# EAGLE design RN2483_01 (EAGLE 6.1)
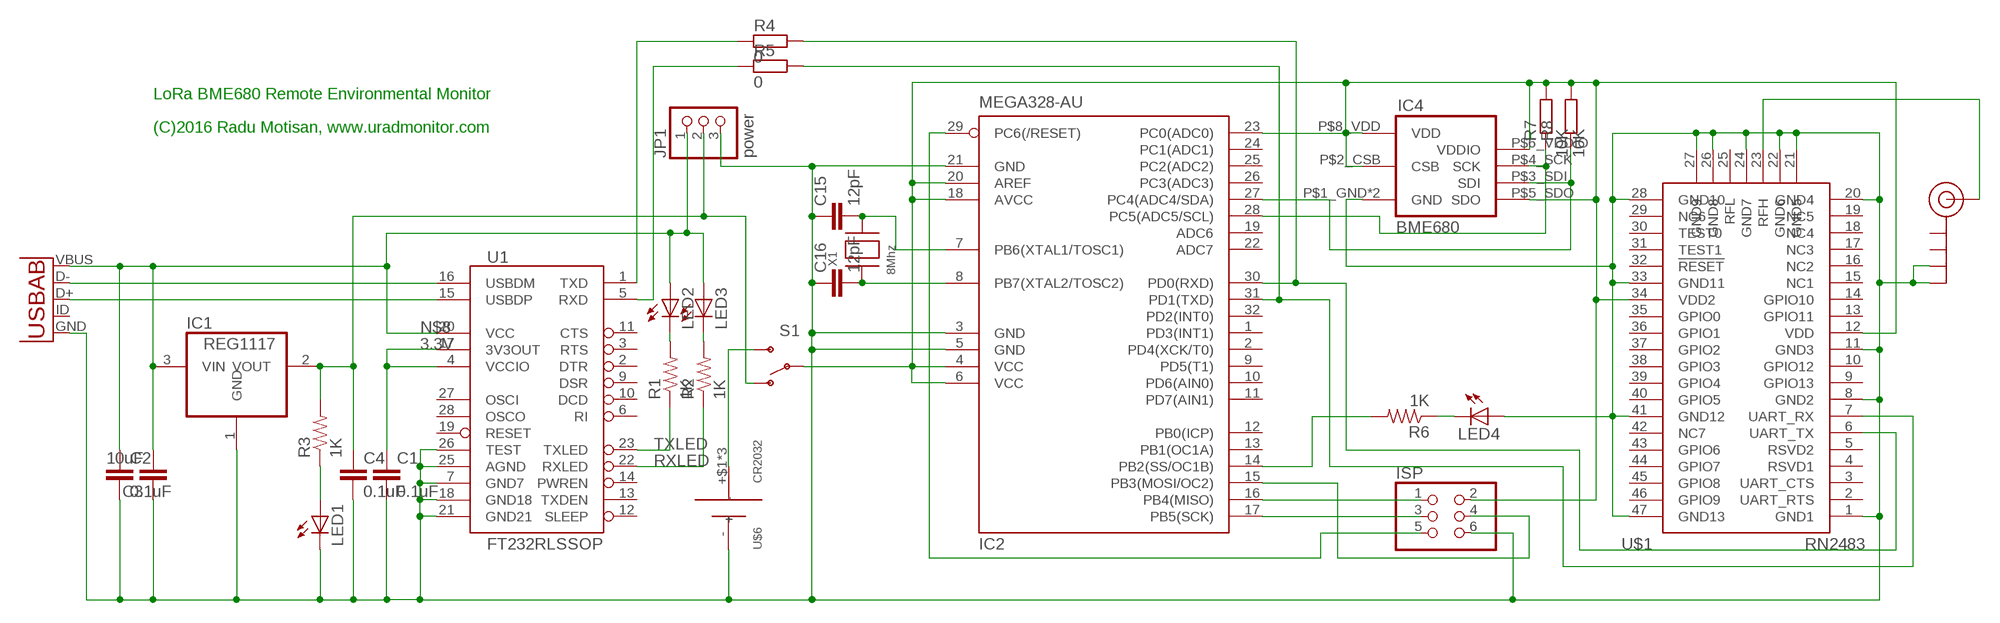
[diagram p0: schematic, sheet 1]

## Parts
C1  0.1uF  CAP0805  [0805]
C2  0.1uF  CAP0805  [0805]
C3  10uF  C-EUC0805K  [C0805K]
C4  0.1uF  CAP0805  [0805]
C15  12pF  C-EUC0805K  [C0805K]
C16  12pF  C-EUC0805K  [C0805K]
IC1  REG1117  [SOT223]
IC2  MEGA328-AU  MEGA8-AI  [TQFP32-08]
IC4  BME680  [BME680]
ISP  PINHD-2X3  [2X03]
J$1  SMA_EDGE  [SMA-EDGE]
JP1  power  PINHD-1X3  [1X03]
LED1  LEDCHIP-LED0805  [CHIP-LED0805]
LED2  LEDCHIP-LED0805  [CHIP-LED0805]
LED3  LEDCHIP-LED0805  [CHIP-LED0805]
LED4  LEDCHIP-LED0805  [CHIP-LED0805]
R1  1K  RESISTOR0805-RES  [0805]
R2  1K  RESISTOR0805-RES  [0805]
R3  1K  RESISTOR0805-RES  [0805]
R4  0  R-EU_R0805  [R0805]
R5  0  R-EU_R0805  [R0805]
R6  1K  RESISTOR0805-RES  [0805]
R7  10K  R-EU_R0805  [R0805]
R8  10K  R-EU_R0805  [R0805]
S1  SWITCH-SPDT-SMD-A  [SWITCH-SPST-SMD-A]
U1  FT232RLSSOP  [SSOP28DB]
U$1  RN2483  [RN2483]
U$2  USB_AB  [USB-AB-MICRO-SMD]
U$6  CR2032  [CR2032]
X1  8Mhz  XTALNX5032  [NX5032]

## Nets
3.3V [power]: C1.1 U1.4(VCCIO) U1.17(3V3OUT)
GND: C1.2 C2.2 C3.1 C4.2 C15.1 C16.1 IC1.1(GND) IC2.3(GND) IC2.5(GND) IC2.21(GND) IC4.P$1_GND(GND) IC4.P$7_GND(GND) ISP.6 J$1.GND@2(GND) J$1.GND@3(GND) JP1.3 LED1.C LED4.A U1.7(GND7) U1.18(GND18) U1.21(GND21) U1.25(AGND) U1.26(TEST) U$1.1(GND1) U$1.8(GND2) U$1.11(GND3) U$1.20(GND4) U$1.21(GND5) U$1.22(GND6) U$1.24(GND7) U$1.26(GND8) U$1.27(GND9) U$1.28(GND10) U$1.33(GND11) U$1.41(GND12) U$1.47(GND13) U$2.GND U$6.-
N$1: LED2.C R1.2
N$2: LED3.C R2.2
N$3: U1.16(USBDM) U$2.D-
N$4: U1.15(USBDP) U$2.D+
N$5: C4.1 IC1.2(VOUT) JP1.2 R3.2 S1.1(O)
N$6: IC2.30(PD0(RXD)) R4.2 U$1.6(UART_TX)
N$7: IC2.14(PB2(SS/OC1B)) R6.2
N$8: C2.1 C3.2 IC1.3(VIN) JP1.1 LED2.A LED3.A U1.20(VCC) U$2.VBUS
N$9: R4.1 U1.1(TXD)
N$10: S1.3(S) U$6.+$1(+) U$6.+$2(+) U$6.+$3(+)
N$11: IC2.16(PB4(MISO)) ISP.1
N$12: IC2.17(PB5(SCK)) ISP.3
N$13: IC2.15(PB3(MOSI/OC2)) ISP.4
N$14: IC2.29(PC6(/RESET)) ISP.5
N$15: J$1.SIG(SIGNAL) U$1.23(RFH)
N$16: LED4.C R6.1
N$17: C15.2 IC2.7(PB6(XTAL1/TOSC1)) X1.P$2
N$18: C16.2 IC2.8(PB7(XTAL2/TOSC2)) X1.P$1
N$19: R5.1 U1.5(RXD)
N$25: IC2.28(PC5(ADC5/SCL)) IC4.P$4_SCK(SCK) R7.1
N$26: IC2.27(PC4(ADC4/SDA)) IC4.P$3_SDI(SDI) R8.1
N$44: IC2.31(PD1(TXD)) R5.2 U$1.7(UART_RX)
N$45: LED1.A R3.1
RXLED: R2.1 U1.22(RXLED)
TXLED: R1.1 U1.23(TXLED)
VCC: IC2.4(VCC) IC2.6(VCC) IC2.18(AVCC) IC2.20(AREF) IC2.23(PC0(ADC0)) IC4.P$2_CSB(CSB) IC4.P$5_SDO(SDO) IC4.P$6_VDDIO(VDDIO) IC4.P$8_VDD(VDD) ISP.2 R7.2 R8.2 S1.2(P) U$1.12(VDD) U$1.34(VDD2)
Unconnected: IC2.1(PD3(INT1)) IC2.2(PD4(XCK/T0)) IC2.9(PD5(T1)) IC2.10(PD6(AIN0)) IC2.11(PD7(AIN1)) IC2.12(PB0(ICP)) IC2.13(PB1(OC1A)) IC2.19(ADC6) IC2.22(ADC7) IC2.24(PC1(ADC1)) IC2.25(PC2(ADC2)) IC2.26(PC3(ADC3)) IC2.32(PD2(INT0)) J$1.GND@0(GND) J$1.GND@1(GND) U1.2(DTR) U1.3(RTS) U1.6(RI) U1.9(DSR) U1.10(DCD) U1.11(CTS) U1.12(SLEEP) U1.13(TXDEN) U1.14(PWREN) U1.19(RESET) U1.27(OSCI) U1.28(OSCO) U$1.2(UART_RTS) U$1.3(UART_CTS) U$1.4(RSVD1) U$1.5(RSVD2) U$1.9(GPIO13) U$1.10(GPIO12) U$1.13(GPIO11) U$1.14(GPIO10) U$1.15(NC1) U$1.16(NC2) U$1.17(NC3) U$1.18(NC4) U$1.19(NC5) U$1.25(RFL) U$1.29(NC6) U$1.30(TEST0) U$1.31(TEST1) U$1.32(!RESET) U$1.35(GPIO0) U$1.36(GPIO1) U$1.37(GPIO2) U$1.38(GPIO3) U$1.39(GPIO4) U$1.40(GPIO5) U$1.42(NC7) U$1.43(GPIO6) U$1.44(GPIO7) U$1.45(GPIO8) U$1.46(GPIO9) U$2.ID(USBID)

## Notes on the sheet
- LoRa BME680 Remote Environmental Monitor
- (C)2016 Radu Motisan, www.uradmonitor.com

## Library data of the parts
C1 C2 C4 = SparkFun:CAP: Capacitor Standard 0603 ceramic capacitor, and 0.1" leaded capacitor.
C3 C15 C16 = rcl:C-EU: CAPACITOR, European symbol
IC1 = burr-brown:REG1117: 800mA and 1A Low Dropout (LDO) Positive Regulator 1.8V, 2.5V, 2.85V, 3.3V, 5V, and Adj; MPN: REG1117; OC_FARNELL: 1097566; OC_NEWARK: 14P6981
IC2 = atmel:MEGA8: MICROCONTROLLER 8 Kbytes FLASH, 1 kbytes SRAM, 512 bytes EEPROM, USART, 6-channel 10 bit ADC, 2-channel 8 bit ADC Pin compatible with Atmega48, ATMega88, ATMega168 Source: avr.lbr; MPN: ATMEGA8-16AU; OC_FARNELL: 9171371; OC_NEWARK: 73M8863
IC4 = uradmonitor:BME680
ISP = pinhead:PINHD-2X3: PIN HEADER
J$1 = sparkfun-connectors:SMA_EDGE: SMA Antenna Connector End launch SMA connector. The paste layer has been removed so that the connector can be hand soldered onto the board after reflow.
JP1 = adafruit:PINHD-1X3: PIN HEADER
LED1-LED4 = adafruit:LED: LED OSRAM: - CHIPLED LG R971, LG N971, LY N971, LG Q971, LY Q971, LO R971, LY R971 LH N974, LH R974 LS Q976, LO Q976, LY Q976 LO Q996 - Hyper CHIPLED LW Q18S LB Q993, LB Q99A, LB R99A - SideLED LS A670, LO A670, LY A670, LG A670, LP A670 LB A673, LV A673, LT A673, LW A673 LH A674 LY A675 LS A676, LA A676, LO A676, LY A676, LW A676 LS A679, LY A679, LG A679 - Hyper Micro SIDELED® LS Y876, LA Y876, LO Y876, LY Y876 LT Y87S - SmartLED LW L88C, LW L88S LB L89C, LB L89S, LG L890 LS L89K, LO L89K, LY L89K LS L896, LA L896, LO L896, LY L896 - TOPLED LS T670, LO T670, LY T670, LG T670, LP T670 LSG T670, LSP T670, LSY T670, LOP T670, LYG T670 LG T671, LOG T671, LSG T671 LB T673, LV T673, LT T673, LW T673 LH T674 LS T676, LA T676, LO T676, LY T676, LB T676, LH T676, LSB T676, LW T676 LB T67C, LV T67C, LT T67C, LS T67K, LO T67K, LY T67K, LW E67C LS E67B, LA E67B, LO E67B, LY E67B, LB E67C, LV E67C, LT E67C LW T67C LS T679, LY T679, LG T679 LS T770, LO T770, LY T770, LG T770, LP T770 LB T773, LV T773, LT T773, LW T773 LH T774 LS E675, LA E675, LY E675, LS T675 LS T776, LA T776, LO T776, LY T776, LB T776 LHGB T686 LT T68C, LB T68C - Hyper Mini TOPLED® LB M676 - Mini TOPLED Santana® LG M470 LS M47K, LO M47K, LY M47K Source: http://www.osram.convergy.de/
R1-R3 R6 = SparkFun:RESISTOR: Resistor Basic schematic elements and footprints for 0603, 1206, and PTH resistors.
R4 R5 R7 R8 = rcl:R-EU_: RESISTOR, European symbol
S1 = sparkfun-electromechanical:SWITCH-SPDT: SPDT Switch Simple slide switch, Spark Fun Electronics SKU : COM-00102 DPDT SMT slide switch, AYZ0202, SWCH-08179
U1 = SparkFun:FT232RL: USB UART FT232RL 4th Generation USB UART (USB <-> Serial) Controller. Spark Fun Electronics SKU : COM-00650
U$1 = uradmonitor:RN2483
U$2 = sparkfun-connectors:USB_AB: This is a USB AB connector that is compatible with USB OTG. i.e. this connector can serve as a host or device
U$6 = uradmonitor:CR2032
X1 = adafruit:XTAL: Low cost SMT crystals, no capacitors included http://www.ladyada.net/library/eagle

## Net classes
1 power: width 0.254 mm

## Board
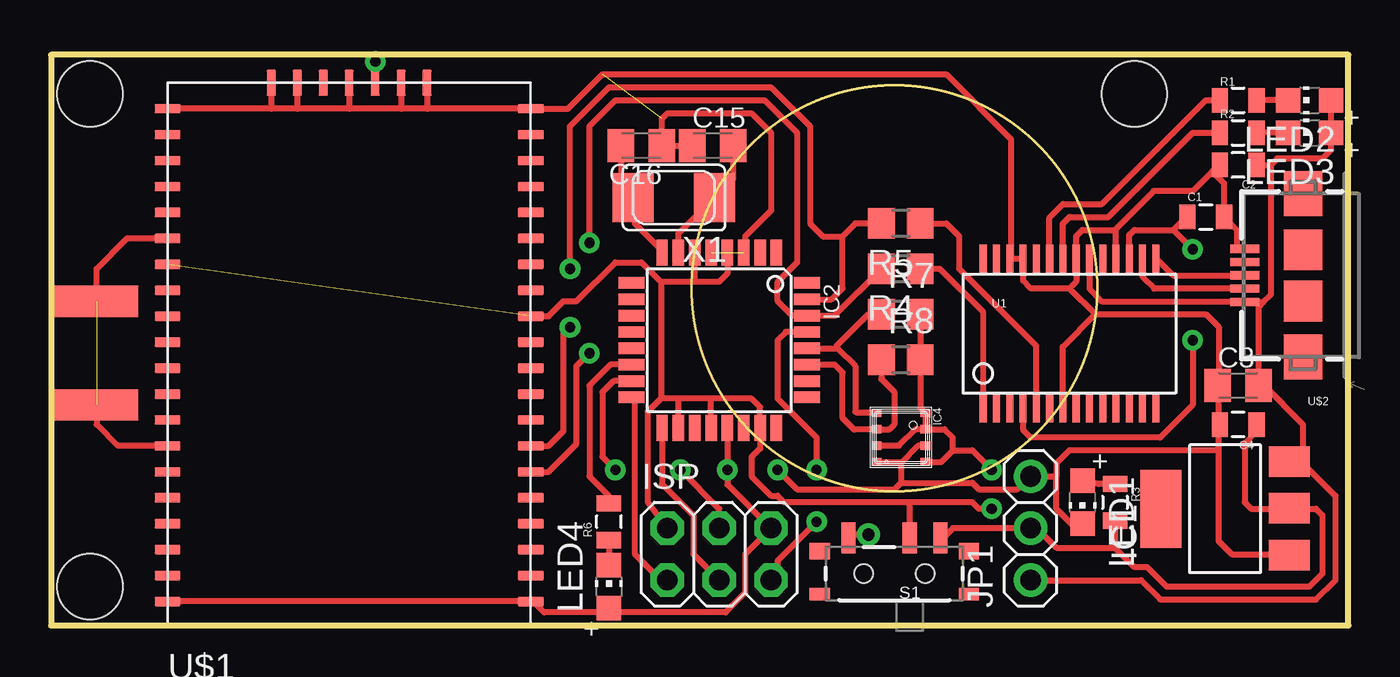
[diagram p1: board, top side]
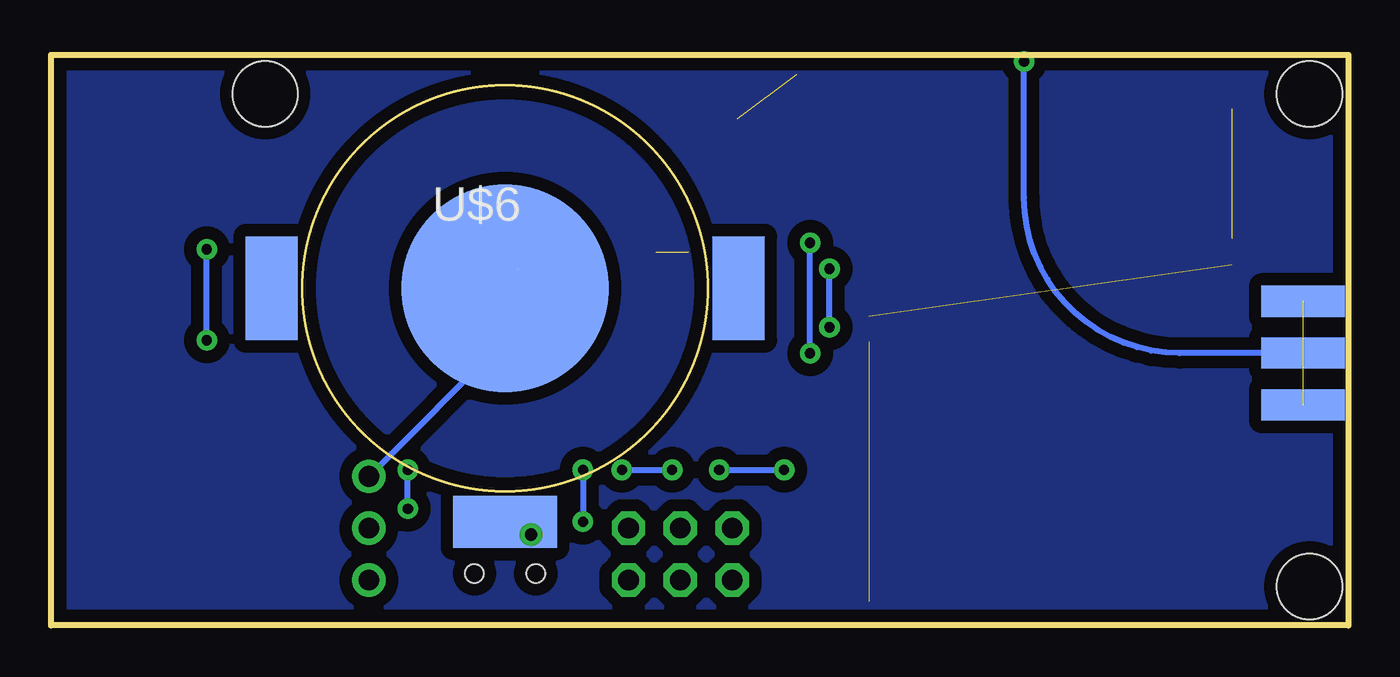
[diagram p2: board, bottom side, seen from below]

Size 63.5 x 27.94 mm. Coordinates in mm from the lower left corner, seen from the top.
Outline: 63.5,27.94 0,27.94 0,0 63.5,0 63.5,27.94
Copper layers (1*16): Top 0.035mm / dielectric 1.5mm / Bottom 0.035mm
Design rules: minimum track width 8mil, minimum drill 20mil, track to track 8mil, track to pad 8mil, pad to pad 8mil, via to via 8mil, smd to smd 8mil, copper to edge 8mil, drill to drill 8mil, minimum pad ring 12mil, minimum via ring 10mil, stop-mask expansion 4mil, vias tented up to drill 20mil, thermal gap 10mil
Holes 3.2 mm at 1.91,26.03 1.91,1.9 53.02,26.03

### Footprints (pad centres in the part's own frame; a part is rotated, then mirrored left to right if it is on the bottom)
0805 = smd 0.8 x 1.2: 1 -0.9,0; 2 0.9,0
C0805K = smd 1.3 x 1.6: 1 -1,0; 2 1,0
SOT223 = smd 1.499 x 2.007: 1 -2.261,-3.15; 2 0.025,-3.15; 3 2.311,-3.15 | smd 3.81 x 2.007: 4 0,3.15
TQFP32-08 = smd 1.27 x 0.559: 1 -4.293,2.8; 2 -4.293,2; 3 -4.293,1.2; 4 -4.293,0.4; 5 -4.293,-0.4; 6 -4.293,-1.2; 7 -4.293,-2; 8 -4.293,-2.8; 17 4.293,-2.8; 18 4.293,-2; 19 4.293,-1.2; 20 4.293,-0.4; 21 4.293,0.4; 22 4.293,1.2; 23 4.293,2; 24 4.293,2.8 | smd 0.559 x 1.27: 9 -2.8,-4.293; 10 -2,-4.293; 11 -1.2,-4.293; 12 -0.4,-4.293; 13 0.4,-4.293; 14 1.2,-4.293; 15 2,-4.293; 16 2.8,-4.293; 25 2.8,4.293; 26 2,4.293; 27 1.2,4.293; 28 0.4,4.293; 29 -0.4,4.293; 30 -1.2,4.293; 31 -2,4.293; 32 -2.8,4.293
BME680 = smd 0.4 x 0.5: P$1_GND 1.2,-1.2; P$2_CSB 0.4,-1.2; P$3_SDI -0.4,-1.2; P$4_SCK -1.2,-1.2; P$5_SDO -1.2,1.2; P$6_VDDIO -0.4,1.2; P$7_GND 0.4,1.2; P$8_VDD 1.2,1.2
2X03 = drill 1.016 octagon: 1 -2.54,-1.27; 2 -2.54,1.27; 3 0,-1.27; 4 0,1.27; 5 2.54,-1.27; 6 2.54,1.27
SMA-EDGE = smd 1.524 x 4.064: GND@0 0,0; GND@1 5.08,0; SIG 2.54,0 | smd 1.524 x 4.064 bottom: GND@2 0,0; GND@3 5.08,0
1X03 = drill 1.016: 1 -2.54,0; 2 0,0; 3 2.54,0
CHIP-LED0805 = smd 1.2 x 1.2: A 0,-1.05; C 0,1.05
R0805 = smd 1.3 x 1.5: 1 -0.95,0; 2 0.95,0
SWITCH-SPST-SMD-A = smd 0.7 x 1.5: 1 -2.25,-1.75; 2 -0.75,-1.75; 3 2.25,-1.75 | smd 1 x 0.6: GND1 -3.65,1; GND3 3.65,1 | smd 1 x 0.8: GND2 -3.65,-1.1; GND4 3.65,-1.1 | hole 0.9: -1.5,0; 1.5,0
SSOP28DB = smd 0.348 x 1.397: 1 -4.225,-3.656; 2 -3.575,-3.656; 3 -2.925,-3.656; 4 -2.275,-3.656; 5 -1.625,-3.656; 6 -0.975,-3.656; 7 -0.325,-3.656; 8 0.325,-3.656; 9 0.975,-3.656; 10 1.625,-3.656; 11 2.275,-3.656; 12 2.925,-3.656; 13 3.575,-3.656; 14 4.225,-3.656; 15 4.225,3.656; 16 3.575,3.656; 17 2.925,3.656; 18 2.275,3.656; 19 1.625,3.656; 20 0.975,3.656; 21 0.325,3.656; 22 -0.325,3.656; 23 -0.975,3.656; 24 -1.625,3.656; 25 -2.275,3.656; 26 -2.925,3.656; 27 -3.575,3.656; 28 -4.225,3.656
RN2483 = smd 1.27 x 0.45: 1 8.89,-12.7; 2 8.89,-11.43; 3 8.89,-10.16; 4 8.89,-8.89; 5 8.89,-7.62; 6 8.89,-6.35; 7 8.89,-5.08; 8 8.89,-3.81; 9 8.89,-2.54; 10 8.89,-1.27; 11 8.89,0; 12 8.89,1.27; 13 8.89,2.54; 14 8.89,3.81; 15 8.89,5.08; 16 8.89,6.35; 17 8.89,7.62; 18 8.89,8.89; 19 8.89,10.16; 20 8.89,11.43; 28 -8.89,11.43; 29 -8.89,10.16; 30 -8.89,8.89; 31 -8.89,7.62; 32 -8.89,6.35; 33 -8.89,5.08; 34 -8.89,3.81; 35 -8.89,2.54; 36 -8.89,1.27; 37 -8.89,0; 38 -8.89,-1.27; 39 -8.89,-2.54; 40 -8.89,-3.81; 41 -8.89,-5.08; 42 -8.89,-6.35; 43 -8.89,-7.62; 44 -8.89,-8.89; 45 -8.89,-10.16; 46 -8.89,-11.43; 47 -8.89,-12.7 | smd 0.45 x 1.27: 21 3.81,12.7; 22 2.54,12.7; 23 1.27,12.7; 24 0,12.7; 25 -1.27,12.7; 26 -2.54,12.7; 27 -3.81,12.7
USB-AB-MICRO-SMD = smd 1.4 x 0.4: D+ 2.85,0; D- 2.85,0.65; GND 2.85,-1.3; ID 2.85,-0.65; VBUS 2.85,1.3 | smd 1.9 x 2: P$6 0,1.25; P$7 0,-1.25 | smd 1.9 x 2.2: P$8 0,4; P$9 0,-4
CR2032 = smd 2.54 x 5.08: +$1 -11.43,0; +$2 11.43,0 | smd 5.08 x 2.54: +$3 0,-11.43 | smd 10.16 x 10.16: - 0,0
NX5032 = smd 2 x 2.4: P$1 2,0; P$2 -2,0

### Placement (x,y rotation side)
C1  56.52,20 0 top
C2  58.1,22.54 180 top
C3  58.1,11.75 0 top
C4  58.1,9.84 180 top
C15  32.39,23.49 0 top
C16  28.89,23.49 180 top
IC1  57.47,5.71 90 top
IC2  32.7,13.97 270 top
IC4  41.59,9.21 270 top
ISP  32.7,3.49 0 top
J$1  2.22,10.79 90 bottom
JP1  47.94,4.76 90 top
LED1  50.48,6.03 180 top
LED2  61.59,25.72 90 top
LED3  61.59,24.13 90 top
LED4  27.3,1.9 0 top
R1  58.1,25.72 0 top
R2  58.1,24.13 0 top
R3  52.07,6.03 270 top
R4  41.59,17.46 180 top
R5  41.59,19.69 180 top
R6  27.3,5.08 90 top
R7  41.59,15.24 0 top
R8  41.59,13.02 0 top
S1  41.27,2.54 180 top
U1  49.85,14.29 0 top
U$1  14.59,13.87 0 top
U$2  61.28,17.14 180 top
U$6  41.27,16.51 0 bottom
X1  30.48,20.95 180 top

### Tracks (layer width: path | path; a pad name or v marks a point on that pad's centre or on a via)
3.3V  (via drill 0.5)
  Top 0.305: U1.17 52.77,19.12 53.02,19.37 54.93,19.37 | U1.4 47.57,9.58 47.94,9.21 54.29,9.21 55.88,10.79 v55.88,13.97 | 54.93,19.37 v55.88,18.41 55.93,18.47 | C1.1 55.56,20 54.93,19.37
  Bottom 0.305: v55.88,13.97 v55.88,18.41
GND  (via drill 0.5)  (6 unrouted)
  Top 0.305: 49.85,16.51 50.17,16.84 U1.21 50.17,19.06 50.48,19.37 52.07,19.37 52.12,19.42 | 49.85,16.51 47.94,16.51 47.57,16.88 U1.25 U1.26 46.99,18.01 46.99,23.81 43.81,26.99 26.99,26.99 25.3,25.3 U$1.20 18.42,25.3 | 49.85,16.51 51.12,15.24 | U1.7 49.52,13.64 51.12,15.24 | U$2.GND 58.07,18.45 58.07,19.34 C1.2 57.42,21.64 56.83,22.23 | 60.33,2.86 61.21,2.86 IC1.1 60.92,3.45 60.96,3.49 | 57.15,8.57 57.15,4.13 57.78,3.49 60.96,3.49 | 57.15,8.57 57.15,9.79 C4.2 57.15,9.89 57.15,11.7 | U1.18 52.12,19.42 | 51.12,15.24 56.52,15.24 57.15,14.61 57.15,11.7 | 52.12,19.42 53.98,21.27 55.88,21.27 56.83,22.23 | 57.15,11.7 C3.1 | C2.2 57.15,22.54 56.83,22.23 | 60.96,3.49 61.28,3.49 | LED1.C 50.9,4.76 50.16,4.76 49.21,5.71 49.21,7.3 | 49.21,7.3 JP1.3 47.31,6.67 45.4,6.67 45.09,6.98 41.59,6.98 | U$1.47 U$1.1 23.59,1.17 24.13,0.63 27.3,0.63 | IC2.21 v33.1,7.62 33.1,6.9 ISP.6 33.97,3.49 33.97,1.59 33.02,0.63 27.3,0.63 | v35.56,7.62 36.51,6.67 41.27,6.67 41.59,6.98 | IC4.P$7_GND 42.46,8.81 41.59,7.94 | IC4.P$1_GND 41.52,8.01 41.59,7.94 | 41.59,7.94 41.59,6.98 | J$1.GND@3 2.22,17.46 3.71,18.95 U$1.33 | J$1.GND@2 2.22,9.84 3.27,8.79 U$1.41 | 18.42,25.3 17.15,25.3 | 17.15,25.3 14.61,25.3 | 14.61,25.3 12.07,25.3 | 12.07,25.3 10.8,25.3 | 10.8,25.3 U$1.28 | U$1.27 10.78,25.32 10.8,25.3 | U$1.26 12.05,25.32 12.07,25.3 | U$1.24 14.59,25.32 14.61,25.3 | U$1.22 17.13,25.32 17.15,25.3 | U$1.21 18.4,26.66 18.42,26.67 18.42,25.3 | C15.1 C16.1 29.89,24.81 30.16,25.08 34.29,25.08 35.24,24.13 35.24,20.32 33.97,19.05 33.97,18.33 IC2.3 | 57.15,8.57 49.85,8.57 49.21,7.94 49.21,7.3 | LED4.A 27.3,0.63
  Bottom 0.305: U$6.- 41.27,13.97 JP1.3 | v35.56,7.62 v33.1,7.62
N$1
  Top 0.305: LED2.C R1.2
N$2
  Top 0.305: LED3.C R2.2
N$3
  Top 0.305: U1.16 53.42,17.06 53.99,16.49 U$2.D-
N$4
  Top 0.305: U$2.D+ 54.93,17.14 54.13,17.94 U1.15
N$5
  Top 0.305: 61.23,5.71 58.74,5.71 58.42,6.03 58.42,8.89 59,9.47 C4.1 | 61.23,5.71 IC1.2 | 52.07,3.81 49.21,3.81 48.26,4.76 JP1.2 44.13,4.76 43.52,4.15 | S1.1 43.52,4.15 | 43.52,4.15 43.5,4.13 | 61.23,5.71 61.91,5.71 62.23,5.4 62.23,2.54 61.59,1.9 54.61,1.9 53.66,2.86 53.02,2.86 52.07,3.81 | R3.2 52.07,3.81
N$6  (via drill 0.5)  (1 unrouted)
  Top 0.305: R4.2 38.35,15.17 IC2.30 36.27,15.17 35.56,15.88 35.56,16.83 36.51,17.78 36.51,24.13 34.93,25.72 27.62,25.72 26.35,24.45 v26.35,18.73 | U$1.6 24.35,7.52 25.72,8.89 25.72,12.7 v26.35,13.34
  Bottom 0.305: v26.35,13.34 v26.35,18.73
N$7
  Top 0.305: IC2.14 27.38,12.77 26.35,11.75 26.35,7.3 27.3,6.35 R6.2
N$8
  Top 0.305: U1.20 50.82,16.49 51.47,15.84 U$2.VBUS 59.34,15.84 | 61.28,7.62 61.28,7.94 | 61.28,8.32 IC1.3 | LED2.A LED3.A 62.65,23.27 62.23,22.86 60.01,22.86 59.69,22.54 | 59.69,22.54 59.69,16.19 59.34,15.84 | 59.34,15.84 59.1,15.61 C3.2 59.37,11.75 61.28,9.84 61.28,8.32 | 61.28,8.32 61.28,8.05 | 61.28,8.05 IC1.3 | C2.1 59.69,22.54 | JP1.1 53.34,2.22 54.29,1.27 61.91,1.27 62.87,2.22 62.87,6.35 61.28,7.94 | 61.34,7.94 IC1.3 | 61.28,8.05 61.28,7.94
N$9
  Top 0.305: U1.1 45.62,15.34 43.5,17.46 R4.1
N$10  (via drill 0.6)
  Top 0.305: v40.01,4.44 38.87,4.44 S1.3
  Bottom 0.305: U$6.+$3 40.64,5.08 v40.01,4.44
N$11
  Top 0.305: ISP.1 29.84,2.22 28.58,3.49 28.58,11.02 IC2.16
N$12
  Top 0.305: IC2.17 29.9,6.93 31.43,5.4 31.43,3.49 ISP.3
N$13  (via drill 0.5)
  Top 0.305: ISP.4 32.7,5.71 v30.8,7.62 | IC2.15 27.53,11.97 26.99,11.43 26.99,8.25 v27.62,7.62
  Bottom 0.305: v30.8,7.62 v27.62,7.62
N$14  (via drill 0.5)
  Top 0.305: IC2.29 35.96,14.37 35.56,13.97 35.56,11.11 37.47,9.21 v37.47,7.62 | v37.47,5.08 35.56,3.17 35.56,2.54 ISP.5
  Bottom 0.305: v37.47,7.62 v37.47,5.08
N$15  (via drill 0.5)
  Top 0.305: U$1.23 15.86,27.29 15.88,27.3 v15.88,27.62
  Bottom 0.305: J$1.SIG 8.26,13.34 arc90 15.88,20.95 v15.88,27.62
N$16
  Top 0.305: R6.1 LED4.C 27.3,3.49
N$17
  Top 0.305: IC2.7 30.7,19.18 X1.P$2 33.39,21.86 C15.2
N$18
  Top 0.305: IC2.8 29.9,18.36 28.58,19.69 28.58,20.86 X1.P$1 27.89,21.54 C16.2
N$19
  Top 0.305: U1.5 48.22,13.69 44.45,17.46 44.45,19.05 43.81,19.69 R5.1
N$20  (via drill 0.5)
  other vias: 35.24,2.22
N$21  (via drill 0.5)
  other vias: 35.24,4.76
N$22  (via drill 0.5)
  other vias: 32.7,4.76
N$23  (via drill 0.5)
  other vias: 32.7,2.22
N$24  (via drill 0.5)
  other vias: 30.16,2.22
N$25
  Top 0.305: IC4.P$4_SCK 39.44,10.41 39.37,10.48 39.37,12.7 38.5,13.57 | IC2.28 38.5,13.57 | R7.1 40.01,15.24 38.42,13.65 38.5,13.57
N$26
  Top 0.305: IC2.27 38.35,12.77 38.73,12.38 38.73,10.16 39.3,9.59 40.39,9.59 IC4.P$3_SDI 41.04,9.61 41.27,9.84 41.27,11.43 40.64,12.06 R8.1
N$27  (via drill 0.5)
  other vias: 30.16,4.76
N$44  (via drill 0.5)
  Top 0.305: IC2.31 38.2,15.97 38.73,16.51 38.73,19.05 | R5.2 39.37,19.69 38.73,19.05 | U$1.7 24.35,8.79 25.08,9.52 25.08,14.29 v25.4,14.61 | v25.4,17.46 25.4,24.45 27.3,26.35 35.24,26.35 37.15,24.45 37.15,19.69 37.78,19.05 38.73,19.05
  Bottom 0.305: v25.4,14.61 v25.4,17.46
N$45
  Top 0.305: R3.1 51.27,6.93 LED1.A
N$201  (via drill 0.5)
  other vias: 1.91,1.9
N$211  (via drill 0.5)
  other vias: 1.91,26.03
N$221  (via drill 0.5)
  other vias: 53.02,26.03
N$231
  pour Bottom (isolate 0.61): 0,0 63.5,0 63.5,27.94 0,27.94
RXLED
  Top 0.305: U1.22 49.52,19.68 49.85,20 51.75,20 55.88,24.13 R2.1
TXLED
  Top 0.305: U1.23 48.87,19.98 49.53,20.64 51.44,20.64 56.52,25.72 R1.1
VCC  (via drill 0.5)  (1 unrouted)
  Top 0.305: v46.04,5.71 45.4,5.71 45.09,6.03 41.91,6.03 | 41.91,6.03 35.88,6.03 35.56,6.35 35.24,6.35 34.29,7.3 34.29,8.25 34.7,8.67 IC2.23 34.7,10.7 34.29,11.11 32.39,11.11 | IC2.18 30.7,11.02 30.8,11.11 | ISP.2 29.21,6.03 29.21,10.48 29.84,11.11 | R7.2 R8.2 42.54,10.66 IC4.P$5_SDO IC4.P$6_VDDIO | IC4.P$2_CSB 41.51,8.81 42.31,9.61 IC4.P$6_VDDIO | IC4.P$8_VDD 43.57,8.01 44.13,8.57 | 44.13,8.57 44.13,9.21 43.73,9.61 IC4.P$6_VDDIO | 29.84,16.83 28.89,17.78 27.62,17.78 25.72,15.88 25.08,15.88 24.35,15.14 U$1.12 | 32.39,11.11 30.8,11.11 | 30.8,11.11 29.84,11.11 | IC2.20 32.3,11.03 32.39,11.11 | IC2.4 33.1,17.23 32.7,16.83 31.43,16.83 | 31.43,16.83 29.84,16.83 | IC2.6 31.5,16.9 31.43,16.83 | 29.84,16.83 29.84,11.11 | S1.2 42.02,5.92 41.91,6.03 | 44.13,8.57 45.09,8.57 v46.04,7.62
  Bottom 0.305: v46.04,5.71 v46.04,7.62